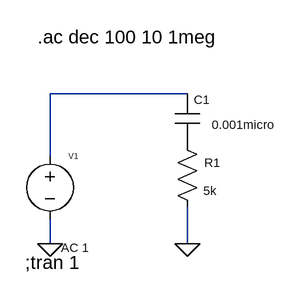
[diagram p0: schematic highpass2.asc]
highpass2.asc, the LTspice schematic file:
Version 4
SHEET 1 880 680
WIRE 256 64 80 64
WIRE 80 144 80 64
WIRE 80 256 80 224
WIRE 256 256 256 208
FLAG 80 256 0
FLAG 256 256 0
SYMBOL voltage 80 128 R0
WINDOW 3 14 105 Invisible 2
WINDOW 123 14 133 Left 1
WINDOW 39 0 0 Left 0
WINDOW 0 24 16 Left 0
SYMATTR Value 0
SYMATTR Value2 AC 1
SYMATTR InstName V1
SYMBOL cap 240 64 R0
WINDOW 0 24 8 Left 1
WINDOW 3 127 40 Right 1
SYMATTR InstName C1
SYMATTR Value 0.001micro
SYMBOL res 240 112 R0
WINDOW 0 58 40 Right 1
WINDOW 3 36 76 Left 1
SYMATTR InstName R1
SYMATTR Value 5k
TEXT 48 280 Left 2 !;tran 1
TEXT 64 -8 Left 2 !.ac dec 100 10 1meg

The netlist it stands for:
* highpass2.asc
V1 N001 0 0 AC 1
C1 N001 P001 0.001micro
R1 P001 0 5k
;tran 1
.ac dec 100 10 1meg
.backanno
.end